# Altium project Bee Hive MainBoard ver1.PrjPcb
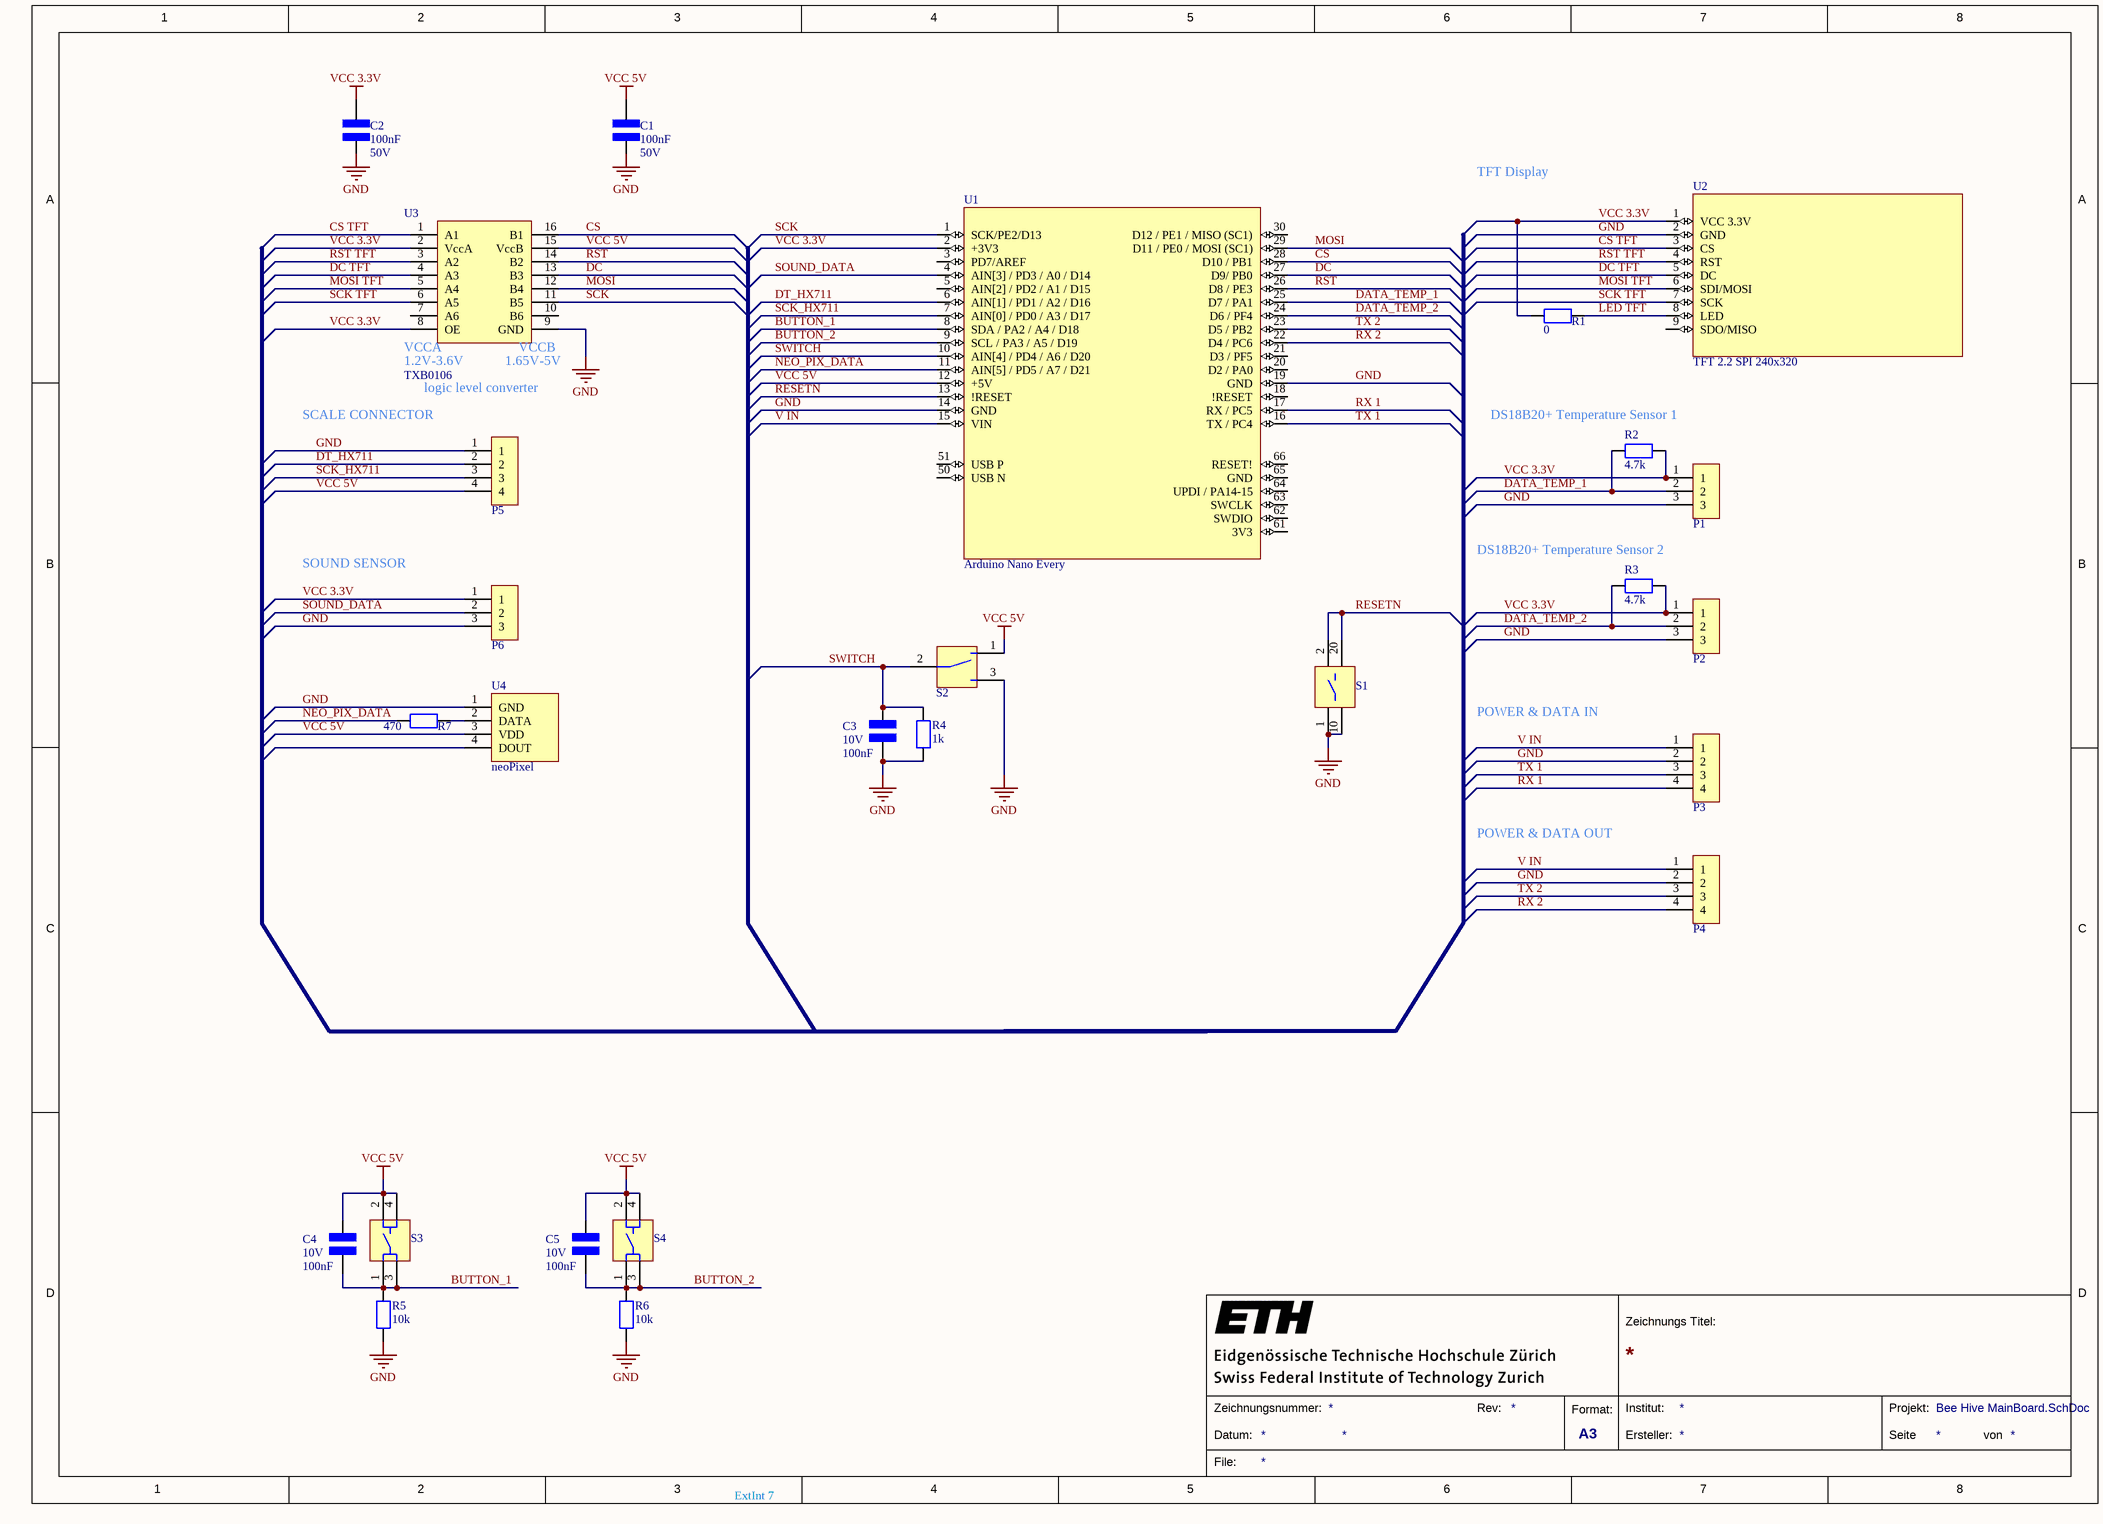
[diagram p0: Bee Hive MainBoard.SchDoc]
1 sheet, 26 parts. Net scope: global (net labels, ports and power ports of the same name join across sheets).
Board file: Bee Hive MainBoard PCB.PcbDoc

## Sheet Bee Hive MainBoard.SchDoc
size A3

### Parts
C1  value 100nF  Umax: 50V  [CAP 0603]  (hidden comment: 100nF 0603_1)
C2  value 100nF  Umax: 50V  [CAP 0603]  (hidden comment: 100nF 0603_1)
C3  value 100nF  Umax: 10V  [CAP 0603]  (hidden comment: 100nF 0603)
C4  value 100nF  Umax: 10V  [CAP 0603]  (hidden comment: 100nF 0603)
C5  value 100nF  Umax: 10V  [CAP 0603]  (hidden comment: 100nF 0603)
P1  3-Pin Right Angle Housing  [3PIN - RND 205-EK254-2.54-03P]  (value not drawn)
P2  3-Pin Right Angle Housing  [3PIN - RND 205-EK254-2.54-03P]  (value not drawn)
P3  4-Pin Right Angle Housing  [4PIN - RND 205-EK254-2.54-04P]  (value not drawn)
P4  4-Pin Right Angle Housing  [4PIN - RND 205-EK254-2.54-04P]  (value not drawn)
P5  4-Pin Right Angle Housing  [4PIN - RND 205-EK254-2.54-04P]  (value not drawn)
P6  3-Pin Right Angle Housing  [3PIN - RND 205-EK254-2.54-03P]  (value not drawn)
R1  value 0  [RES 0603 FOOTPRINT]  (hidden comment: 0 Ohm 0603)
R2  value 4.7k  [RES 0603 FOOTPRINT]  (hidden comment: 4.7k Ohm 0603)
R3  value 4.7k  [RES 0603 FOOTPRINT]  (hidden comment: 4.7k Ohm 0603)
R4  value 1k  [RES 0603 FOOTPRINT]  (hidden comment: 1k Ohm 0603)
R5  value 10k  [RES 0603 FOOTPRINT]  (hidden comment: 10k Ohm 0603)
R6  value 10k  [RES 0603 FOOTPRINT]  (hidden comment: 10k Ohm 0603)
R7  value 470  [RES 0603 FOOTPRINT]  (hidden comment: 470 Ohm 0603)
S1  Taster Print_SMD_2  [Taster Print - SMD - KMR241G LFS]  (value not drawn)
S2  Schiebeschalter 7A11-A1PCAE2  [schiebeschalter 7A11-A1PCAE2]  (value not drawn)
S3  Taster Print_SMD_3  [Taster Print RND 210-00212]  (value not drawn)
S4  Taster Print_SMD_3  [Taster Print RND 210-00212]  (value not drawn)
U1  Arduino Nano Every  [Arduino Nano Every]
U2  TFT 2.2 SPI 240x320  [TFT 2.2 SPI 240x320]
U3  TXB0106  [TSSOP-16L]
U4  neoPixel  [neoPixel 5050 adafruit 1655]

### Nets
GND: C1.1 C2.1 C3.2 P1.3 P2.3 P3.2 P4.2 P5.1 P6.3 R4.1 R5.1 R6.1 S1.1 S1.10 S2.3 U1.14(GND) U1.19(GND) U2.2(GND) U3.9(GND) U4.1(GND)
VCC 3.3V: C2.2 P1.1 P2.1 P6.1 R1.2 R2.1 R3.1 U1.2(+3V3) U2.1(VCC_3.3V) U3.2(VccA) U3.8(OE)
VCC 5V: C1.2 C4.1 C5.1 P5.4 S2.1 S3.2 S3.4 S4.2 S4.4 U1.12(+5V) U3.15(VccB) U4.3(VDD)
BUTTON_1: C4.2 R5.2 S3.1 S3.3 U1.8(SDA_/_PA2_/_A4_/_D18)
BUTTON_2: C5.2 R6.2 S4.1 S4.3 U1.9(SCL_/_PA3_/_A5_/_D19)
CS: U1.28(D10_/_PB1) U3.16(B1)
CS TFT: U2.3(CS) U3.1(A1)
DATA_TEMP_1: P1.2 R2.2 U1.25(D7_/_PA1)
DATA_TEMP_2: P2.2 R3.2 U1.24(D6_/_PF4)
DC: U1.27(D9/_PB0) U3.13(B3)
DC TFT: U2.5(DC) U3.4(A3)
DT_HX711: P5.2 U1.6(AIN[1]_/_PD1_/_A2_/_D16)
LED TFT: R1.1 U2.8(LED)
MOSI: U1.29(D11_/_PE0_/_MOSI_(SC1)) U3.12(B4)
MOSI TFT: U2.6(SDI/MOSI) U3.5(A4)
NEO_PIX_DATA: R7.1 U1.11(AIN[5]_/_PD5_/_A7_/_D21)
RESETN: S1.2 S1.20 U1.13(!RESET)
RST: U1.26(D8_/_PE3) U3.14(B2)
RST TFT: U2.4(RST) U3.3(A2)
RX 1: P3.4 U1.17(RX_/_PC5)
RX 2: P4.4 U1.22(D4_/_PC6)
SCK: U1.1(SCK/PE2/D13) U3.11(B5)
SCK TFT: U2.7(SCK) U3.6(A5)
SCK_HX711: P5.3 U1.7(AIN[0]_/_PD0_/_A3_/_D17)
SOUND_DATA: P6.2 U1.4(AIN[3]_/_PD3_/_A0_/_D14)
SWITCH: C3.1 R4.2 S2.2 U1.10(AIN[4]_/_PD4_/_A6_/_D20)
TX 1: P3.3 U1.16(TX_/_PC4)
TX 2: P4.3 U1.23(D5_/_PB2)
V IN: P3.1 P4.1 U1.15(VIN)
NetR7_2: R7.2 U4.2(DATA)

Not connected (* = marked no-connect by the designer): U1 3(PD7/AREF) 5(AIN[2]_/_PD2_/_A1_/_D15) 18(!RESET) 20(D2_/_PA0) 21(D3_/_PF5) 30(D12_/_PE1_/_MISO_(SC1)) 50(USB_N) 51(USB_P) 61(3V3) 62(SWDIO) 63(SWCLK) 64(UPDI_/_PA14-15) 65(GND) 66(RESET!); U2 9(SDO/MISO); U3 7(A6) 10(B6); U4 4(DOUT)

### Notes on the sheet
- TFT Display
- SCALE CONNECTOR
- logic level converter
- (near R2) DS18B20+ Temperature Sensor 1
- SOUND SENSOR
- (near R3) DS18B20+ Temperature Sensor 2
- POWER & DATA IN
- POWER & DATA OUT
- ExtInt 7
- 1
- 2
- 3
- 4
- 5
- 6
- 7
- 8
- A
- B
- C
- D
- Zeichnungs Titel:
- Datum:
- Zeichnungsnummer:
- Rev:
- Format:
- A3
- Ersteller:
- Institut:
- Seite
- Projekt:
- von
- File:
- (in symbol TXB0106 Level Converter) VCCA; VCCB; 1.2V-3.6V; 1.65V-5V

### Library data of the parts
C1 C2 = 100nF 0603_1: C CERAMIC SMD; Bezeichnung: C SMD; Hersteller: Yageo; Hersteller Nr: CC0603JPX7R9BB104; Haendler: Mouser; Haendler Nr: 603-CC0603JPX79BB104; Preis (CHF): 0.15; housing/footprint: 0603
C3-C5 = 100nF 0603: C CERAMIC SMD; Bezeichnung: C SMD; Hersteller: Würth; Hersteller Nr: 885012206020; Haendler: Mouser; Haendler Nr: 710-885012206020; Preis (CHF): 0.05; housing/footprint: 0603
P1 P2 P6 = 3-Pin Screw Terminal: 3-Pin; Preis (CHF): 0.60; Haendler: Distrelec; Haendler Nr: 301-27-919; ComponentLink1Description: Mouser; ComponentLink1URL: https://www.mouser.ch/ProductDetail/TE-Connectivity/640453-2?qs=sGAEpiMZZMs%252bGHln7q6pm5E1Eb6qwPl2KIU5TYv3tVY%3d
P3-P5 = 4-Pin Screw Terminal: 4-Pin; Preis (CHF): 0.60; Haendler: Distrelec; Hersteller: RND; Hersteller Nr: RND 205-EK254-2.54-04P; Haendler Nr: 301-27-920; ComponentLink1Description: Mouser; ComponentLink1URL: https://www.mouser.ch/ProductDetail/TE-Connectivity/640453-2?qs=sGAEpiMZZMs%252bGHln7q6pm5E1Eb6qwPl2KIU5TYv3tVY%3d
R1 = 0 Ohm 0603: R SMD; Hersteller: ERJ-3GEY0R00V; Hersteller Nr: Panasonic; Haendler: Mouser; Haendler Nr: 667-ERJ-3GEY0R00V; Preis (CHF): 0.01; Bezeichnung: R SMD; housing/footprint: 0603
R2 R3 = 4.7k Ohm 0603: R SMD; Haendler: Mouser; Haendler Nr: 755-ESR03EZPF4701; Preis (CHF): 0.01; Bezeichnung: R SMD; housing/footprint: 0603
R4 = 1k Ohm 0603: R SMD; Hersteller Nr: CRCW06031K00FKEAC; Haendler: Mouser; Haendler Nr: 71-CRCW06031K00FKEAC; Preis (CHF): 0.01; Bezeichnung: R SMD; housing/footprint: 0603
R5 R6 = 10k Ohm 0603: R SMD; Hersteller: Yageo; Hersteller Nr: AC0603FR-0710KL; Haendler: Mouser; Haendler Nr: 603-AC0603FR-0710KL; Preis (CHF): 0.01; Bezeichnung: R SMD; housing/footprint: 0603
R7 = 470 Ohm 0603: R SMD; Preis (CHF): 0.15; Haendler: Mouser; HAendler Nr: 594-MCT06030C4700FP5; Bezeichnung: R SMD; housing/footprint: 0603
S1 = Taster Print_SMD_2: Taster; Haendler Nr: 611-KMR241GLFS; Haendler: Mouser; Hersteller: C&K; Hersteller Nr: KMR241G LFS; Preis (CHF): 0.5; Haendler2 Nr: 1437637; Haendler2: Farnell; Link: http://ch.farnell.com/c-k-components/kmr241g-lfs/taster-smd-4n/dp/1437637; Link Hersteller: http://www.ckswitches.com/products/switches/product-details/Tactile/KMR2/KMR241NGLFS/
S2 = Schiebeschalter 7A11-A1PCAE2: Haendler: Distrelec; Haendler Nr: 124-50-166
S3 S4 = Taster Print_SMD_5: Taster; Haendler: Distrelec; Preis (CHF): 0.38; Link: https://www.distrelec.ch/de/printtaster-210-schliesser-45n-6mm-rnd-components-rnd-210-00212/p/30090668?q=PRINTTASTER&pos=2&origPos=45&origPageSize=100&track=true; Haendler Nr: 300-90-668; ComponentLink1Description: link; ComponentLink1URL: https://www.digikey.ch/product-detail/de/wurth-electronics-inc/430473035826/732-7021-1-ND/5225469
U1 = Arduino Nano Every: https://store.arduino.cc/nano-every-pack; Preis (CHF): 11.21; Haendler: Mouser; Haendler Nr: 782-ABX00028; Link: https://store.arduino.cc/nano-every-pack; ComponentLink3URL: http://ch.farnell.com/stmicroelectronics/stm32l496vgt6/mcu-arm-cortex-m4-80mhz-lqfp-100/dp/2725139?st=STM32L496VGT6; Link 2: https://www.mouser.ch/ProductDetail/Arduino/ABX00028?qs=PzGy0jfpSMtit6rnFl8mVg%3D%3D
U2 = TFT 2.2 SPI 240x320: https://www.banggood.com/1_441_82_02_22_4-Inch-TFT-LCD-Display-Module-Colorful-Screen-Module-SPI-Interface-p-1494883.html?rmmds=search&ID=6211522&cur_warehouse=CN; Preis (CHF): 6; Haendler: Banggood / Aliexpress; Link: https://www.banggood.com/1_441_82_02_22_4-Inch-TFT-LCD-Display-Module-Colorful-Screen-Module-SPI-Interface-p-1494883.html?rmmds=search&ID=6211522&cur_warehouse=CN; ComponentLink3URL: http://ch.farnell.com/stmicroelectronics/stm32l496vgt6/mcu-arm-cortex-m4-80mhz-lqfp-100/dp/2725139?st=STM32L496VGT6; Link 2: https://de.aliexpress.com/item/4000839144387.html?spm=a2g0o.productlist.0.0.48ed5371jjv3wJ&algo_pvid=f087815a-197e-468a-8055-d99fc6734484&algo_expid=f087815a-197e-468a-8055-d99fc6734484-8&btsid=0ab50f6115912653966648062e4a8e&ws_ab_test=searchweb0_0,searchweb201602_,searchweb201603_
U3 = TXB0106 Level Converter: Level Converter TXB0106; Hersteller: Texas Instruments; Haendler: Mouser; Haendler Nr: 595-TXB0106PWR; Preis (CHF): 1.45; Haendler2: Farnell; Haendler2 Nr: 1694679; Hersteller Nr: TXB0106; Link: http://ch.farnell.com/texas-instruments/txb0106pwr/txb-transceiver-tssop16/dp/1694679?ost=1694679&searchView=table&iscrfnonsku=false&ddkey=http%3Ade-CH%2FElement14_Switzerland%2Fsearch
U4 = neoPixel 5050 adafruit 1655: Preis (CHF): 0.60; Haendler Nr: 485-1655; Haendler: Mouser; Hersteller Nr: 1655; ComponentLink1Description: Mouser; ComponentLink1URL: https://www.mouser.ch/ProductDetail/TE-Connectivity/640453-2?qs=sGAEpiMZZMs%252bGHln7q6pm5E1Eb6qwPl2KIU5TYv3tVY%3d; Hersteller: Adafruit